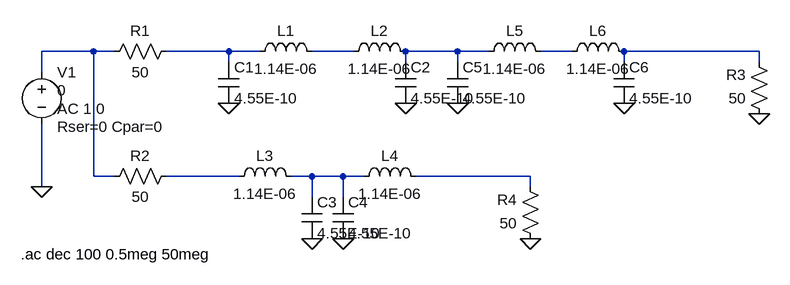
[diagram p0: schematic PAI_T_Filter.asc]
PAI_T_Filter.asc, the LTspice schematic file:
Version 4
SHEET 1 880 680
WIRE -800 -336 -880 -336
WIRE -768 -336 -800 -336
WIRE -592 -336 -688 -336
WIRE -544 -336 -592 -336
WIRE -400 -336 -464 -336
WIRE -240 -336 -320 -336
WIRE -192 -336 -240 -336
WIRE -64 -336 -112 -336
WIRE 224 -336 16 -336
WIRE -592 -320 -592 -336
WIRE -320 -320 -320 -336
WIRE -240 -320 -240 -336
WIRE 16 -320 16 -336
WIRE 224 -320 224 -336
WIRE -880 -304 -880 -336
WIRE -800 -144 -800 -336
WIRE -768 -144 -800 -144
WIRE -576 -144 -688 -144
WIRE -464 -144 -496 -144
WIRE -416 -144 -464 -144
WIRE -384 -144 -416 -144
WIRE -128 -144 -304 -144
WIRE -880 -128 -880 -224
WIRE -128 -128 -128 -144
WIRE -464 -112 -464 -144
WIRE -416 -112 -416 -144
FLAG -880 -128 0
FLAG 224 -240 0
FLAG -320 -256 0
FLAG -592 -256 0
FLAG -464 -48 0
FLAG -416 -48 0
FLAG -128 -48 0
FLAG 16 -256 0
FLAG -240 -256 0
SYMBOL voltage -880 -320 R0
WINDOW 3 24 44 Left 0
WINDOW 123 24 72 Left 0
WINDOW 39 24 100 Left 0
SYMATTR Value 0
SYMATTR Value2 AC 1 0
SYMATTR SpiceLine Rser=0 Cpar=0
SYMATTR InstName V1
SYMBOL res -672 -352 R90
WINDOW 0 0 56 VBottom 0
WINDOW 3 32 56 VTop 0
SYMATTR InstName R1
SYMATTR Value 50
SYMBOL res -672 -160 R90
WINDOW 0 0 56 VBottom 0
WINDOW 3 32 56 VTop 0
SYMATTR InstName R2
SYMATTR Value 50
SYMBOL cap -608 -320 R0
SYMATTR InstName C1
SYMATTR Value 4.55E-10
SYMBOL ind -448 -320 M270
WINDOW 0 32 56 VTop 0
WINDOW 3 5 56 VBottom 0
SYMATTR InstName L1
SYMATTR Value 1.14E-06
SYMBOL cap -336 -320 R0
SYMATTR InstName C2
SYMATTR Value 4.55E-10
SYMBOL cap -480 -112 R0
SYMATTR InstName C3
SYMATTR Value 4.55E-10
SYMBOL cap -432 -112 R0
SYMATTR InstName C4
SYMATTR Value 4.55E-10
SYMBOL ind -480 -128 M270
WINDOW 0 32 56 VTop 0
WINDOW 3 5 56 VBottom 0
SYMATTR InstName L3
SYMATTR Value 1.14E-06
SYMBOL ind -288 -128 M270
WINDOW 0 32 56 VTop 0
WINDOW 3 5 56 VBottom 0
SYMATTR InstName L4
SYMATTR Value 1.14E-06
SYMBOL res 240 -224 R180
WINDOW 0 36 76 Left 0
WINDOW 3 36 40 Left 0
SYMATTR InstName R3
SYMATTR Value 50
SYMBOL res -112 -32 R180
WINDOW 0 36 76 Left 0
WINDOW 3 36 40 Left 0
SYMATTR InstName R4
SYMATTR Value 50
SYMBOL cap -256 -320 R0
SYMATTR InstName C5
SYMATTR Value 4.55E-10
SYMBOL ind -96 -320 M270
WINDOW 0 32 56 VTop 0
WINDOW 3 5 56 VBottom 0
SYMATTR InstName L5
SYMATTR Value 1.14E-06
SYMBOL cap 0 -320 R0
SYMATTR InstName C6
SYMATTR Value 4.55E-10
SYMBOL ind -304 -320 M270
WINDOW 0 32 56 VTop 0
WINDOW 3 5 56 VBottom 0
SYMATTR InstName L2
SYMATTR Value 1.14E-06
SYMBOL ind 32 -320 M270
WINDOW 0 32 56 VTop 0
WINDOW 3 5 56 VBottom 0
SYMATTR InstName L6
SYMATTR Value 1.14E-06
TEXT -912 -24 Left 0 !.ac dec 100 0.5meg 50meg

The netlist it stands for:
* PAI_T_Filter.asc
V1 N001 0 0 AC 1 0 Rser=0 Cpar=0
R1 N002 N001 50
R2 N007 N001 50
C1 N002 0 4.55E-10
L1 N003 N002 1.14E-06
C2 N004 0 4.55E-10
C3 N008 0 4.55E-10
C4 N008 0 4.55E-10
L3 N008 N007 1.14E-06
L4 N009 N008 1.14E-06
R3 0 N006 50
R4 0 N009 50
C5 N004 0 4.55E-10
L5 N005 N004 1.14E-06
C6 N006 0 4.55E-10
L2 N004 N003 1.14E-06
L6 N006 N005 1.14E-06
.ac dec 100 0.5meg 50meg
.backanno
.end